# EAGLE design 555_timer (EAGLE 5.07)
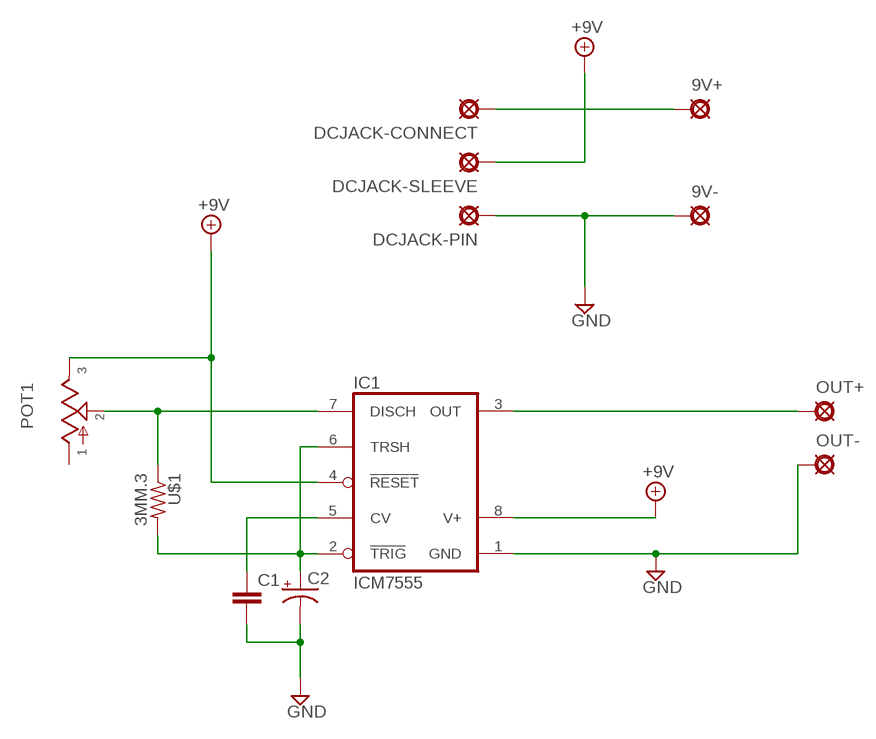
[diagram p0: schematic, sheet 1]

## Parts
9V+  PAD  [SQUARE]
9V-  PAD8  [OCTOGON]
C1  050X030_0251  [050X030_025]
C2  0501  [050_020_1]
DCJACK-CONNECT  PAD  [SQUARE]
DCJACK-PIN  PAD8  [OCTOGON]
DCJACK-SLEEVE  PAD  [SQUARE]
IC1  ICM7555  [DIL08]
OUT+  PAD  [SQUARE]
OUT-  PAD8  [OCTOGON]
POT1  POT  [POT]
U$1  3MM.3  [R0204/3]

## Nets
+9V: DCJACK-SLEEVE.1(PAD) IC1.4(RESET) IC1.8(V+) POT1.3
GND: 9V-.1(PAD) C1.2 C2.- DCJACK-PIN.1(PAD) IC1.1(GND) OUT-.1(PAD)
N$1: IC1.3(OUT) OUT+.1(PAD)
N$2: IC1.7(DISCH) POT1.2 U$1.1
N$3: C1.1 IC1.5(CV)
N$4: C2.+ IC1.2(TRIG) IC1.6(TRSH) U$1.2
N$6: 9V+.1(PAD) DCJACK-CONNECT.1(PAD)
Unconnected: POT1.1

## Library data of the parts
9V+ 9V- DCJACK-CONNECT DCJACK-PIN DCJACK-SLEEVE OUT+ OUT- = gm-supply:PAD: PAD use this package for pads with any purpose, including input, output, send or return various pad shapes: round, square, octogonal, long, and long offset
C1 = gm-caps-ceramic:050X030_025: 47 - 120pF Xicon Ceramic Disc 2.5mm lead spacing
C2 = gm-caps-electro-pol:050: 0.22 - 100uF Xicon values at Mouser.com: 10V: 10 - 100uF; 16V: 2.2 - 47uF; 25V: 0.47 - 47uF; 50V: 0.22 - 22uF
IC1 = maxim:ICM7555: TIMER
POT1 = gm-pots:POT: Potentiometers the arrow indicates the clockwise motion of th wiper (lug 2) fully counter clockwise there is no resistance between lugs 1 and 2 fully clockwise the resistance between lugs 1 and 2 is the value of the pot
U$1 = gm-resistors:3MM: 3mm Resistors Leads spaced 1-6 holes apart for 0.1" perfboard. Suitable for 1/8 watt resistors.

## Board
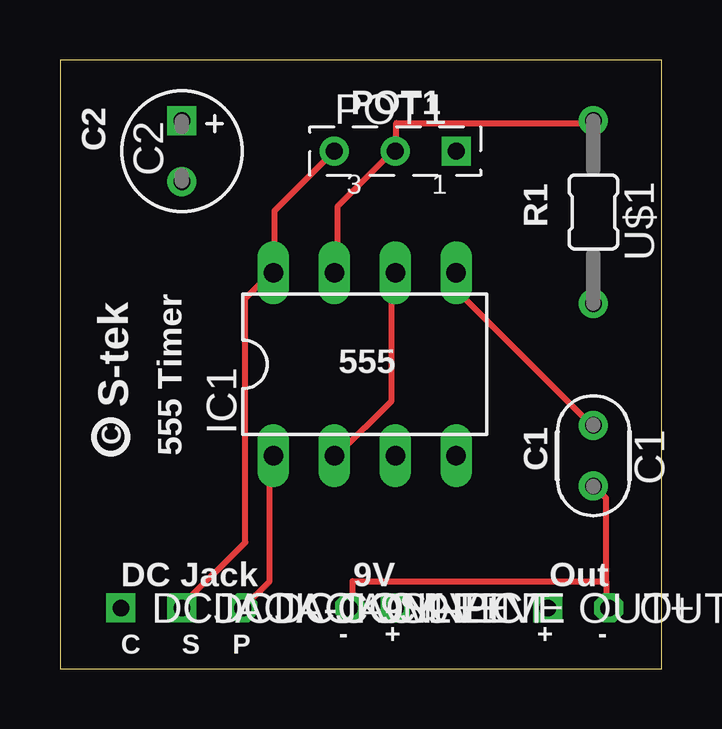
[diagram p1: board, top side]
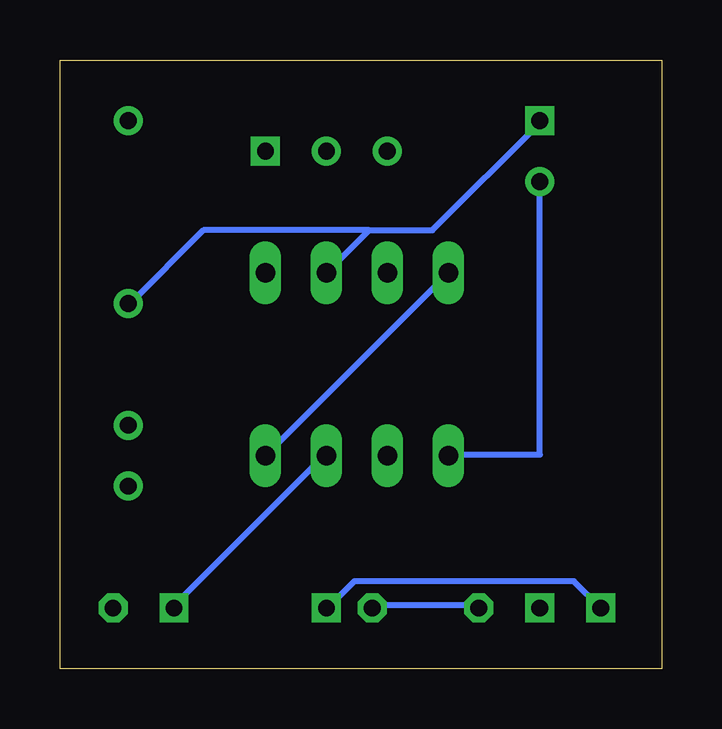
[diagram p2: board, bottom side, seen from below]

Size 25.07 x 25.39 mm. Coordinates in mm from the lower left corner, seen from the top.
Outline: 0,0 25.07,0 25.07,25.39 0,25.39 0,0
Copper layers (1*16): Top 0.035mm / dielectric 1.5mm / Bottom 0.035mm
Design rules "default": minimum track width 10mil, minimum drill 24mil, track to track 8mil, track to pad 8mil, pad to pad 8mil, via to via 8mil, smd to smd 8mil, copper to edge 40mil, drill to drill 8mil, minimum pad ring 10mil, minimum via ring 8mil, stop-mask expansion 4mil, vias tented up to drill 0mil, thermal gap 10mil

### Footprints (pad centres in the part's own frame; a part is rotated, then mirrored left to right if it is on the bottom)
SQUARE = drill 0.7 square: 1 0,0
OCTOGON = drill 0.7 octagon: 1 0,0
050X030_025 = drill 0.7 round: 1 -1.27,0; 2 1.27,0
050_020_1 = drill 0.7 square: + -1.27,0 | drill 0.7 round: - 1.27,0
DIL08 = drill 0.813 long: 1 -3.81,-3.81; 2 -1.27,-3.81; 3 1.27,-3.81; 4 3.81,-3.81; 5 3.81,3.81; 6 1.27,3.81; 7 -1.27,3.81; 8 -3.81,3.81
POT = drill 0.7 square: 1 2.54,0 | drill 0.7 round: 2 0,0; 3 -2.54,0
R0204/3 = drill 0.7 round: 1 -3.81,0; 2 3.81,0

### Placement (x,y rotation side)
9V+  13.97,2.54 0 top
9V-  12.06,2.54 0 top
C1  22.23,8.89 270 top
C2  5.08,21.59 270 top
DCJACK-CONNECT  2.54,2.54 0 top
DCJACK-PIN  7.62,2.54 0 top
DCJACK-SLEEVE  5.08,2.54 0 top
IC1  12.7,12.7 0 top
OUT+  20.32,2.54 0 top
OUT-  22.86,2.54 0 top
POT1  13.97,21.59 0 top
U$1  22.23,19.05 270 top

### Tracks (layer width: path | path; a pad name or v marks a point on that pad's centre or on a via)
+9V
  Top 0.254: DCJACK-SLEEVE.1 5.08,2.64 7.72,5.28 7.72,15.44 8.74,16.46 IC1.8 8.94,16.66 8.94,19.1 POT1.3
  Bottom 0.254: IC1.8 IC1.4
GND
  Top 0.254: 22.76,3.66 22.76,2.64 OUT-.1 | 22.76,3.66 22.76,7.11 22.35,7.52 C1.2 | DCJACK-PIN.1 8.74,3.66 8.74,8.74 IC1.1 | 22.76,3.66 12.19,3.66 12.19,2.64 9V-.1
  Bottom 0.254: DCJACK-PIN.1 7.72,2.64 11.99,2.64 9V-.1 | C2.- 5.08,8.94 8.74,8.94 IC1.1
N$1
  Bottom 0.254: OUT+.1 20.32,2.64 14.22,8.74 14.02,8.74 IC1.3
N$2
  Top 0.254: IC1.7 11.58,16.66 11.58,19.3 13.82,21.54 POT1.2 14.02,21.74 14.02,22.76 22.15,22.76 U$1.1
N$3
  Top 0.254: C1.1 22.15,10.16 16.66,15.65 16.66,16.46 IC1.5
N$4
  Top 0.254: IC1.2 11.58,8.94 13.82,11.18 13.82,16.46 IC1.6
  Bottom 0.254: 12.19,18.29 9.55,18.29 5.08,22.76 C2.+ | IC1.6 12.19,18.29 | 12.19,18.29 19.1,18.29 22.15,15.24 U$1.2
N$6
  Bottom 0.254: DCJACK-CONNECT.1 3.66,3.66 12.8,3.66 13.82,2.64 9V+.1

### Text on the board
tPlace: POT1 | C2 | R1 | 555 | S-tek | C | 555 Timer | C1 | DC Jack | 9V | Out | C | S | P | - | + | + | -